# EAGLE design Feedback-Circuit (EAGLE 9.6.2)
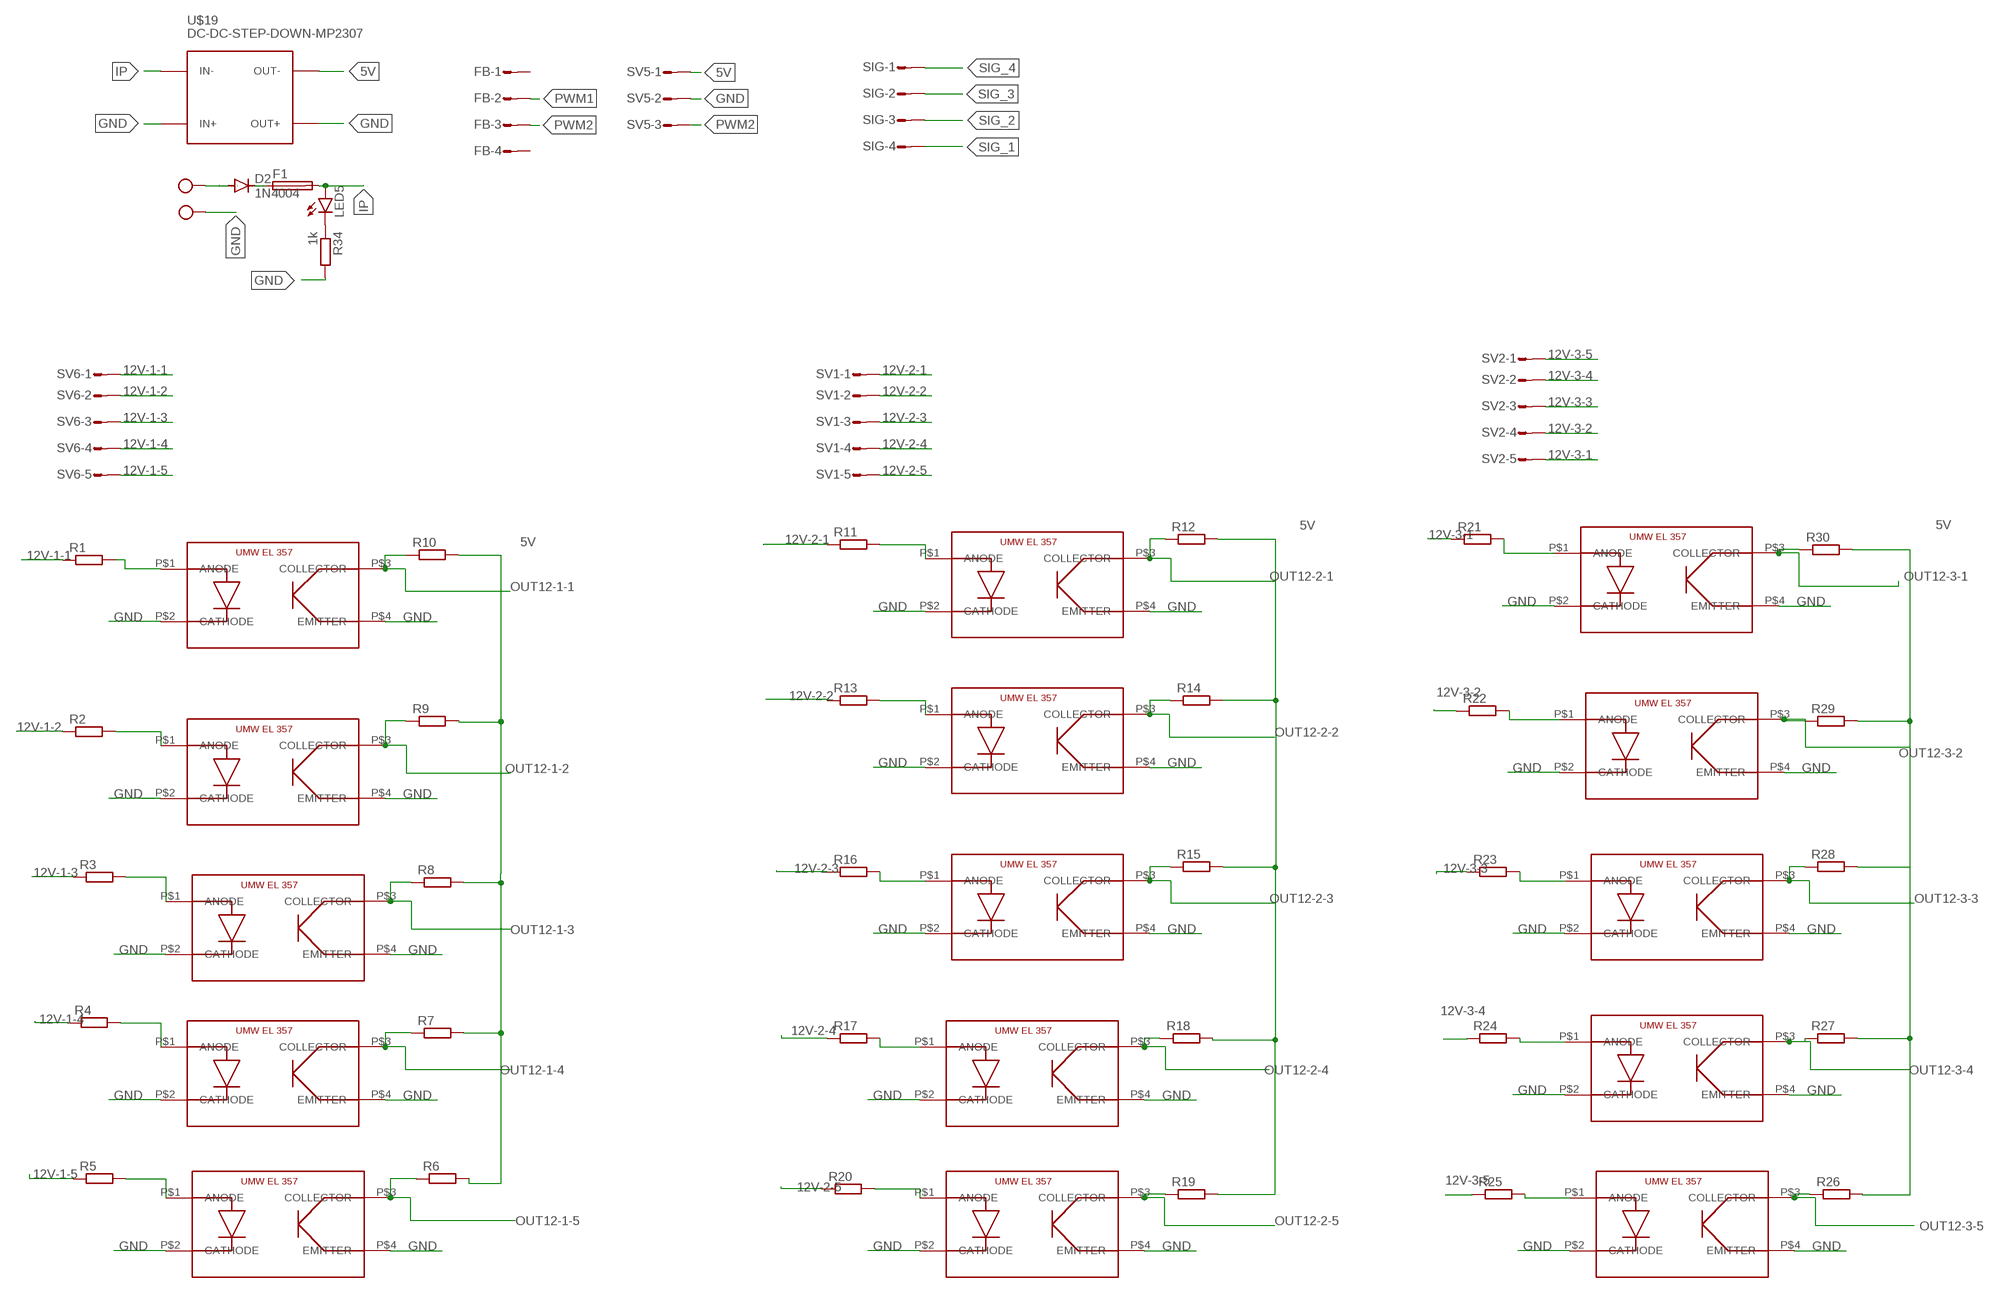
[diagram p0: schematic, sheet 1, part 1 of 2]
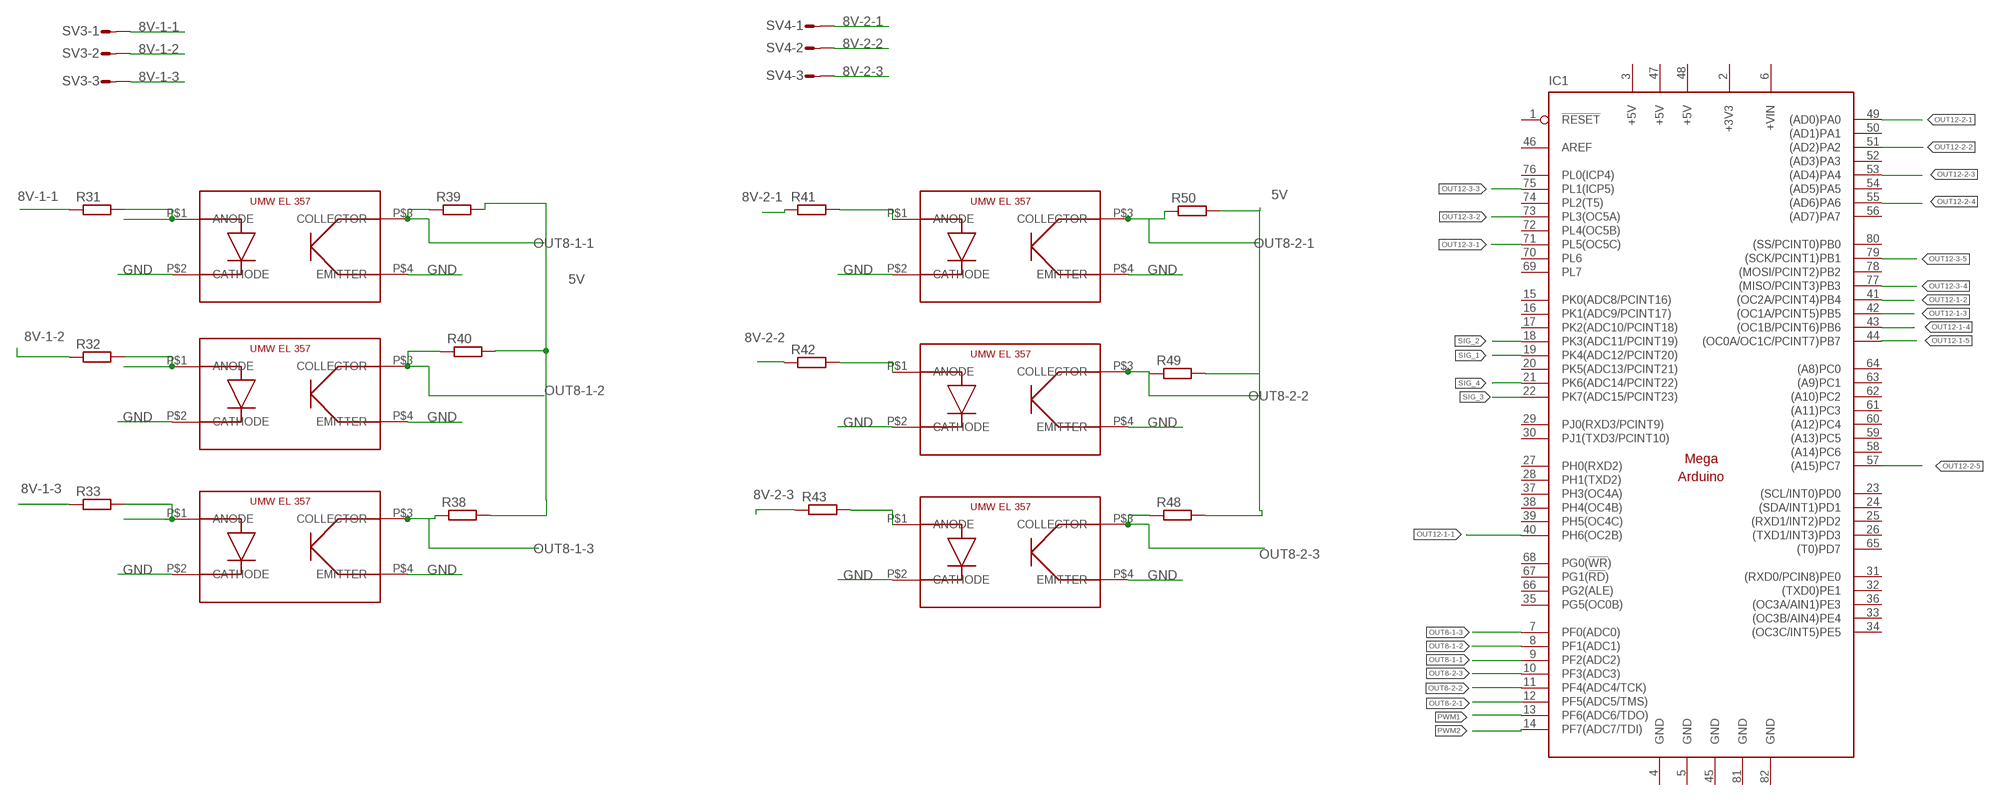
[diagram p1: schematic, sheet 1, part 2 of 2]

## Parts
D2  1N4004  [DO41-10]
F1  FUSE_SH22  [FUSE_SH22]
FB  CON-AMP-MT_S04P  [CON-AMP-MT_S04P]
IC1  MEGAARDUINO_1  [MEGA_ARDUINO]
LED5  LED3MM  [LED3MM]
MAIN-12V  AK300/2  [AK300/2]
R1  R-EU_R1206W  [R1206W]
R2  R-EU_R1206W  [R1206W]
R3  R-EU_R1206W  [R1206W]
R4  R-EU_R1206W  [R1206W]
R5  R-EU_R1206W  [R1206W]
R6  R-EU_R1206W  [R1206W]
R7  R-EU_R1206W  [R1206W]
R8  R-EU_R1206W  [R1206W]
R9  R-EU_R1206W  [R1206W]
R10  R-EU_R1206W  [R1206W]
R11  R-EU_R1206W  [R1206W]
R12  R-EU_R1206W  [R1206W]
R13  R-EU_R1206W  [R1206W]
R14  R-EU_R1206W  [R1206W]
R15  R-EU_R1206W  [R1206W]
R16  R-EU_R1206W  [R1206W]
R17  R-EU_R1206W  [R1206W]
R18  R-EU_R1206W  [R1206W]
R19  R-EU_R1206W  [R1206W]
R20  R-EU_R1206W  [R1206W]
R21  R-EU_R1206W  [R1206W]
R22  R-EU_R1206W  [R1206W]
R23  R-EU_R1206W  [R1206W]
R24  R-EU_R1206W  [R1206W]
R25  R-EU_R1206W  [R1206W]
R26  R-EU_R1206W  [R1206W]
R27  R-EU_R1206W  [R1206W]
R28  R-EU_R1206W  [R1206W]
R29  R-EU_R1206W  [R1206W]
R30  R-EU_R1206W  [R1206W]
R31  R-EU_R1206W  [R1206W]
R32  R-EU_R1206W  [R1206W]
R33  R-EU_R1206W  [R1206W]
R34  1k  R-EU_0207/10  [0207/10]
R38  R-EU_R1206W  [R1206W]
R39  R-EU_R1206W  [R1206W]
R40  R-EU_R1206W  [R1206W]
R41  R-EU_R1206W  [R1206W]
R42  R-EU_R1206W  [R1206W]
R43  R-EU_R1206W  [R1206W]
R48  R-EU_R1206W  [R1206W]
R49  R-EU_R1206W  [R1206W]
R50  R-EU_R1206W  [R1206W]
SIG  CON-AMP-MT_S04P  [CON-AMP-MT_S04P]
SV1  CON-AMP-MT_S05P  [CON-AMP-MT_S05P]
SV2  CON-AMP-MT_S05P  [CON-AMP-MT_S05P]
SV3  CON-AMP-MT_S05P  [CON-AMP-MT_S05P]
SV4  CON-AMP-MT_S05P  [CON-AMP-MT_S05P]
SV5  CON-AMP-MT_S03P  [CON-AMP-MT_S03P]
SV6  CON-AMP-MT_S05P  [CON-AMP-MT_S05P]
U$1  UMWEL357EL357  [OPTOCOUPLER]
U$2  UMWEL357EL357  [OPTOCOUPLER]
U$3  UMWEL357EL357  [OPTOCOUPLER]
U$4  UMWEL357EL357  [OPTOCOUPLER]
U$5  UMWEL357EL357  [OPTOCOUPLER]
U$6  UMWEL357EL357  [OPTOCOUPLER]
U$7  UMWEL357EL357  [OPTOCOUPLER]
U$8  UMWEL357EL357  [OPTOCOUPLER]
U$9  UMWEL357EL357  [OPTOCOUPLER]
U$10  UMWEL357EL357  [OPTOCOUPLER]
U$11  UMWEL357EL357  [OPTOCOUPLER]
U$12  UMWEL357EL357  [OPTOCOUPLER]
U$13  UMWEL357EL357  [OPTOCOUPLER]
U$14  UMWEL357EL357  [OPTOCOUPLER]
U$15  UMWEL357EL357  [OPTOCOUPLER]
U$16  UMWEL357EL357  [OPTOCOUPLER]
U$17  UMWEL357EL357  [OPTOCOUPLER]
U$18  UMWEL357EL357  [OPTOCOUPLER]
U$19  DC-DC-STEP-DOWN-MP2307  [DC-DC-STEP-DOWN-MP2307]
U$21  UMWEL357EL357  [OPTOCOUPLER]
U$22  UMWEL357EL357  [OPTOCOUPLER]
U$23  UMWEL357EL357  [OPTOCOUPLER]

## Nets
5V: R6.2 R7.2 R8.2 R9.2 R10.2 R12.2 R14.2 R15.2 R18.2 R19.2 R26.2 R27.2 R28.2 R29.2 R30.2 R38.2 R39.2 R40.2 R48.2 R49.2 R50.2 SV5.1 U$19.OUT-
8V-1-1: R31.1 SV3.1
8V-1-2: R32.1 SV3.2
8V-1-3: R33.1 SV3.3
8V-2-1: R41.1 SV4.1
8V-2-2: R42.1 SV4.2
8V-2-3: R43.1 SV4.3
12V: D2.A MAIN-12V.1
12V-1-1: R1.1 SV6.1
12V-1-2: R2.1 SV6.2
12V-1-3: R3.1 SV6.3
12V-1-4: R4.1 SV6.4
12V-1-5: R5.1 SV6.5
12V-2-1: R11.1 SV1.1
12V-2-2: R13.1 SV1.2
12V-2-3: R16.1 SV1.3
12V-2-4: R17.1 SV1.4
12V-2-5: R20.1 SV1.5
12V-3-1: R21.1 SV2.5
12V-3-2: R22.1 SV2.4
12V-3-3: R23.1 SV2.3
12V-3-4: R24.1 SV2.2
12V-3-5: R25.1 SV2.1
GND: MAIN-12V.2 R34.2 SV5.2 U$1.P$2(CATHODE) U$1.P$4(EMITTER) U$2.P$2(CATHODE) U$2.P$4(EMITTER) U$3.P$2(CATHODE) U$3.P$4(EMITTER) U$4.P$2(CATHODE) U$4.P$4(EMITTER) U$5.P$2(CATHODE) U$5.P$4(EMITTER) U$6.P$2(CATHODE) U$6.P$4(EMITTER) U$7.P$2(CATHODE) U$7.P$4(EMITTER) U$8.P$2(CATHODE) U$8.P$4(EMITTER) U$9.P$2(CATHODE) U$9.P$4(EMITTER) U$10.P$2(CATHODE) U$10.P$4(EMITTER) U$11.P$2(CATHODE) U$11.P$4(EMITTER) U$12.P$2(CATHODE) U$12.P$4(EMITTER) U$13.P$2(CATHODE) U$13.P$4(EMITTER) U$14.P$2(CATHODE) U$14.P$4(EMITTER) U$15.P$2(CATHODE) U$15.P$4(EMITTER) U$16.P$2(CATHODE) U$16.P$4(EMITTER) U$17.P$2(CATHODE) U$17.P$4(EMITTER) U$18.P$2(CATHODE) U$18.P$4(EMITTER) U$19.IN+ U$19.OUT+ U$21.P$2(CATHODE) U$21.P$4(EMITTER) U$22.P$2(CATHODE) U$22.P$4(EMITTER) U$23.P$2(CATHODE) U$23.P$4(EMITTER)
IP: F1.2 LED5.A U$19.IN-
N$1: R11.2 U$6.P$1(ANODE)
N$3: R2.2 U$2.P$1(ANODE)
N$5: R3.2 U$3.P$1(ANODE)
N$6: R1.2 U$1.P$1(ANODE)
N$7: R4.2 U$4.P$1(ANODE)
N$9: R5.2 U$5.P$1(ANODE)
N$10: R13.2 U$7.P$1(ANODE)
N$11: R16.2 U$8.P$1(ANODE)
N$13: R17.2 U$9.P$1(ANODE)
N$14: R20.2 U$10.P$1(ANODE)
N$15: R21.2 U$11.P$1(ANODE)
N$16: R22.2 U$12.P$1(ANODE)
N$17: R23.2 U$13.P$1(ANODE)
N$18: R24.2 U$14.P$1(ANODE)
N$19: R25.2 U$15.P$1(ANODE)
N$20: R41.2 U$21.P$1(ANODE)
N$21: R42.2 U$22.P$1(ANODE)
N$22: R43.2 U$23.P$1(ANODE)
N$31: R31.2 U$16.P$1(ANODE)
N$33: R32.2 U$17.P$1(ANODE)
N$35: R33.2 U$18.P$1(ANODE)
N$42: LED5.K(C) R34.1
N$46: D2.C F1.1
OUT8-1-1: IC1.9(PF2(ADC2)) R39.1 U$16.P$3(COLLECTOR)
OUT8-1-2: IC1.8(PF1(ADC1)) R40.1 U$17.P$3(COLLECTOR)
OUT8-1-3: IC1.7(PF0(ADC0)) R38.1 U$18.P$3(COLLECTOR)
OUT8-2-1: IC1.12(PF5(ADC5/TMS)) R50.1 U$21.P$3(COLLECTOR)
OUT8-2-2: IC1.11(PF4(ADC4/TCK)) R49.1 U$22.P$3(COLLECTOR)
OUT8-2-3: IC1.10(PF3(ADC3)) R48.1 U$23.P$3(COLLECTOR)
OUT12-1-1: IC1.40(PH6(OC2B)) R10.1 U$1.P$3(COLLECTOR)
OUT12-1-2: IC1.41((OC2A/PCINT4)PB4) R9.1 U$2.P$3(COLLECTOR)
OUT12-1-3: IC1.42((OC1A/PCINT5)PB5) R8.1 U$3.P$3(COLLECTOR)
OUT12-1-4: IC1.43((OC1B/PCINT6)PB6) R7.1 U$4.P$3(COLLECTOR)
OUT12-1-5: IC1.44((OC0A/OC1C/PCINT7)PB7) R6.1 U$5.P$3(COLLECTOR)
OUT12-2-1: IC1.49((AD0)PA0) R12.1 U$6.P$3(COLLECTOR)
OUT12-2-2: IC1.51((AD2)PA2) R14.1 U$7.P$3(COLLECTOR)
OUT12-2-3: IC1.53((AD4)PA4) R15.1 U$8.P$3(COLLECTOR)
OUT12-2-4: IC1.55((AD6)PA6) R18.1 U$9.P$3(COLLECTOR)
OUT12-2-5: IC1.57((A15)PC7) R19.1 U$10.P$3(COLLECTOR)
OUT12-3-1: IC1.71(PL5(OC5C)) R30.1 U$11.P$3(COLLECTOR)
OUT12-3-2: IC1.73(PL3(OC5A)) R29.1 U$12.P$3(COLLECTOR)
OUT12-3-3: IC1.75(PL1(ICP5)) R28.1 U$13.P$3(COLLECTOR)
OUT12-3-4: IC1.77((MISO/PCINT3)PB3) R27.1 U$14.P$3(COLLECTOR)
OUT12-3-5: IC1.79((SCK/PCINT1)PB1) R26.1 U$15.P$3(COLLECTOR)
PWM1: FB.2 IC1.13(PF6(ADC6/TDO))
PWM2: FB.3 IC1.14(PF7(ADC7/TDI)) SV5.3
SIG_1: IC1.19(PK4(ADC12/PCINT20)) SIG.4
SIG_2: IC1.18(PK3(ADC11/PCINT19)) SIG.3
SIG_3: IC1.22(PK7(ADC15/PCINT23)) SIG.2
SIG_4: IC1.21(PK6(ADC14/PCINT22)) SIG.1
Unconnected: FB.1 FB.4 IC1.1(!RESET) IC1.15(PK0(ADC8/PCINT16)) IC1.16(PK1(ADC9/PCINT17)) IC1.17(PK2(ADC10/PCINT18)) IC1.20(PK5(ADC13/PCINT21)) IC1.23((SCL/INT0)PD0) IC1.24((SDA/INT1)PD1) IC1.25((RXD1/INT2)PD2) IC1.26((TXD1/INT3)PD3) IC1.27(PH0(RXD2)) IC1.28(PH1(TXD2)) IC1.29(PJ0(RXD3/PCINT9)) IC1.30(PJ1(TXD3/PCINT10)) IC1.31((RXD0/PCIN8)PE0) IC1.32((TXD0)PE1) IC1.33((OC3B/AIN4)PE4) IC1.34((OC3C/INT5)PE5) IC1.35(PG5(OC0B)) IC1.36((OC3A/AIN1)PE3) IC1.37(PH3(OC4A)) IC1.38(PH4(OC4B)) IC1.39(PH5(OC4C)) IC1.46(AREF) IC1.50((AD1)PA1) IC1.52((AD3)PA3) IC1.54((AD5)PA5) IC1.56((AD7)PA7) IC1.58((A14)PC6) IC1.59((A13)PC5) IC1.60((A12)PC4) IC1.61((A11)PC3) IC1.62((A10)PC2) IC1.63((A9)PC1) IC1.64((A8)PC0) IC1.65((T0)PD7) IC1.66(PG2(ALE)) IC1.67(PG1(!RD!)) IC1.68(PG0(!WR!)) IC1.69(PL7) IC1.70(PL6) IC1.72(PL4(OC5B)) IC1.74(PL2(T5)) IC1.76(PL0(ICP4)) IC1.78((MOSI/PCINT2)PB2) IC1.80((SS/PCINT0)PB0) SV3.4 SV3.5 SV4.4 SV4.5

## Power pins joined to a net without a drawn wire
+3V3: IC1.2(+3V3)
+5V: IC1.3(+5V) IC1.47(+5V) IC1.48(+5V)
+VIN: IC1.6(+VIN)
GND: IC1.4(GND) IC1.5(GND) IC1.45(GND) IC1.81(GND) IC1.82(GND)

## Library data of the parts
D2 = diode:1N4004: DIODE general purpose rectifier, 1 A
F1 = MindCloud:FUSE_SH22: FUSE HOLDER CS PFP30, Schukat; OC_FARNELL: unknown; OC_NEWARK: unknown
FB SIG = MindCloud:CON-AMP-MT_S04P: AMP MT CONNECTOR; OC_FARNELL: unknown; OC_NEWARK: unknown
IC1 = MindCloud:MEGAARDUINO_1: The Arduino Mega is a microcontroller board based on the ATmega1280. - 54 digital input/output pins (of which 14 can be used as PWM outputs) - 16 analog inputs - 4 UARTs (hardware serial ports) - 16 MHz crystal oscillator - USB connection - power jack - ICSP header - reset button It contains everything needed to support the microcontroller; simply connect it to a computer with a USB cable or power it with a AC-to-DC adapter or battery to get started. The Mega is compatible with most shields designed for the Arduino Duemilanove or Diecimila. http://arduino.cc/en/Main/ArduinoBoardMega
LED5 = led:LED: LED OSRAM: - CHIPLED LG R971, LG N971, LY N971, LG Q971, LY Q971, LO R971, LY R971 LH N974, LH R974 LS Q976, LO Q976, LY Q976 LO Q996 - Hyper CHIPLED LW Q18S LB Q993, LB Q99A, LB R99A - SideLED LS A670, LO A670, LY A670, LG A670, LP A670 LB A673, LV A673, LT A673, LW A673 LH A674 LY A675 LS A676, LA A676, LO A676, LY A676, LW A676 LS A679, LY A679, LG A679 - Hyper Micro SIDELED® LS Y876, LA Y876, LO Y876, LY Y876 LT Y87S - SmartLED LW L88C, LW L88S LB L89C, LB L89S, LG L890 LS L89K, LO L89K, LY L89K LS L896, LA L896, LO L896, LY L896 - TOPLED LS T670, LO T670, LY T670, LG T670, LP T670 LSG T670, LSP T670, LSY T670, LOP T670, LYG T670 LG T671, LOG T671, LSG T671 LB T673, LV T673, LT T673, LW T673 LH T674 LS T676, LA T676, LO T676, LY T676, LB T676, LH T676, LSB T676, LW T676 LB T67C, LV T67C, LT T67C, LS T67K, LO T67K, LY T67K, LW E67C LS E67B, LA E67B, LO E67B, LY E67B, LB E67C, LV E67C, LT E67C LW T67C LS T679, LY T679, LG T679 LS T770, LO T770, LY T770, LG T770, LP T770 LB T773, LV T773, LT T773, LW T773 LH T774 LS E675, LA E675, LY E675, LS T675 LS T776, LA T776, LO T776, LY T776, LB T776 LHGB T686 LT T68C, LB T68C - Hyper Mini TOPLED® LB M676 - Mini TOPLED Santana® LG M470 LS M47K, LO M47K, LY M47K Source: http://www.osram.convergy.de LUXEON: - LUMILED® LXK2-PW12-R00, LXK2-PW12-S00, LXK2-PW14-U00, LXK2-PW14-V00 LXK2-PM12-R00, LXK2-PM12-S00, LXK2-PM14-U00 LXK2-PE12-Q00, LXK2-PE12-R00, LXK2-PE12-S00, LXK2-PE14-T00, LXK2-PE14-U00 LXK2-PB12-K00, LXK2-PB12-L00, LXK2-PB12-M00, LXK2-PB14-N00, LXK2-PB14-P00, LXK2-PB14-Q00 LXK2-PR12-L00, LXK2-PR12-M00, LXK2-PR14-Q00, LXK2-PR14-R00 LXK2-PD12-Q00, LXK2-PD12-R00, LXK2-PD12-S00 LXK2-PH12-R00, LXK2-PH12-S00 LXK2-PL12-P00, LXK2-PL12-Q00, LXK2-PL12-R00 Source: www.luxeon.com KINGBRIGHT: KA-3528ASYC Source: www.kingbright.com
MAIN-12V = con-ptr500:AK300/2: CONNECTOR; OC_FARNELL: unknown; OC_NEWARK: unknown
R1-R34 R38-R43 R48-R50 = rcl:R-EU_: RESISTOR, European symbol; SPICEPREFIX: R
SV1-SV4 SV6 = MindCloud:CON-AMP-MT_S05P: AMP MT CONNECTOR; OC_FARNELL: unknown; OC_NEWARK: unknown
SV5 = MindCloud:CON-AMP-MT_S03P: AMP MT CONNECTOR; OC_FARNELL: unknown; OC_NEWARK: unknown
U$1-U$18 U$21-U$23 = EL357 optocoupler:UMWEL357
U$19 = buck 3A:DC-DC-STEP-DOWN-MP2307: DC/DC Step-Down Regulator based on MP2307DN chip MP2307 datasheet available here: https://cdn-shop.adafruit.com/datasheets/MP2307_r1.9.pdf Click here to find device on ebay.com <http://www.ebay.com/sch/dc+dc+3a+mini+converter>

## Board
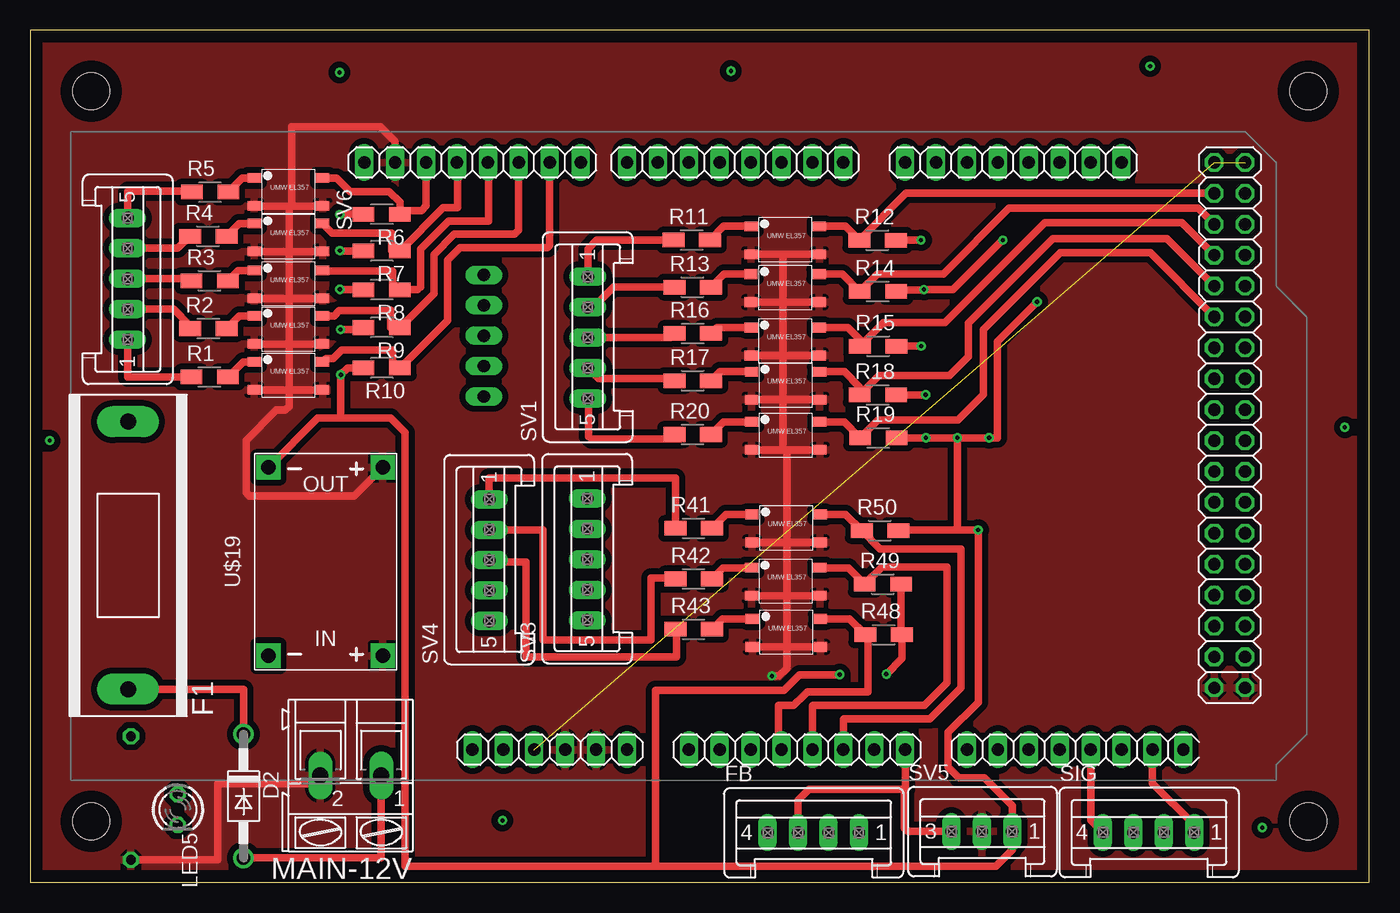
[diagram p2: board, top side]
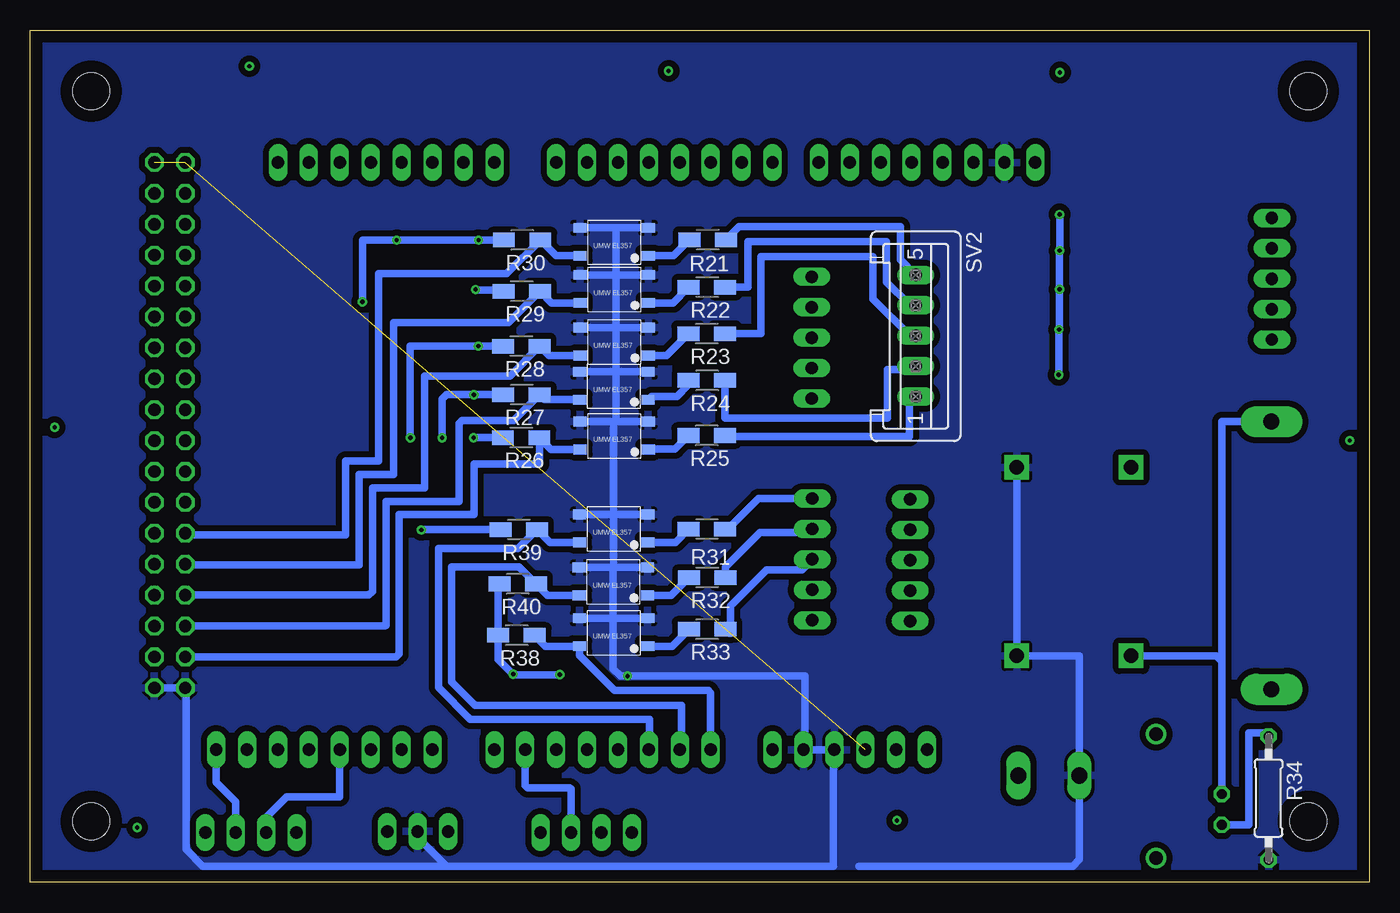
[diagram p3: board, bottom side, seen from below]

Size 110 x 70 mm. Coordinates in mm from the lower left corner, seen from the top.
Outline: 0,0 110,0 110,70 0,70 0,0
Copper layers (1*16): Top 0.035mm / dielectric 1.5mm / Bottom 0.035mm
Design rules "default *": minimum track width 0.6mm, minimum drill 0.35mm, track to track 0.5mm, track to pad 0.5mm, pad to pad 0.5mm, via to via 0.5mm, smd to smd 6mil, copper to edge 40mil, drill to drill 6mil, minimum pad ring 10mil, minimum via ring 8mil, stop-mask expansion 4mil, vias tented up to drill 0mil, thermal gap 10mil
Holes 3 mm at 105,65 105,5 5,5 5,65

### Footprints (pad centres in the part's own frame; a part is rotated, then mirrored left to right if it is on the bottom)
DO41-10 = drill 1.118: A 5.08,0; C -5.08,0
FUSE_SH22 = drill 1.321 pad 2.54 long: 1 -10.998,0; 2 10.998,0
CON-AMP-MT_S04P = drill 1.016 long: 1 3.75,0; 2 1.25,0; 3 -1.25,0; 4 -3.75,0
MEGA_ARDUINO = drill 1.016 long: 1 33.02,2.54; 2 35.56,2.54; 3 38.1,2.54; 4 40.64,2.54; 5 43.18,2.54; 6 45.72,2.54; 7 50.8,2.54; 8 53.34,2.54; 9 55.88,2.54; 10 58.42,2.54; 11 60.96,2.54; 12 63.5,2.54; 13 66.04,2.54; 14 68.58,2.54; 15 73.66,2.54; 16 76.2,2.54; 17 78.74,2.54; 18 81.28,2.54; 19 83.82,2.54; 20 86.36,2.54; 21 88.9,2.54; 22 91.44,2.54; 23 86.36,50.8; 24 83.82,50.8; 25 81.28,50.8; 26 78.74,50.8; 27 76.2,50.8; 28 73.66,50.8; 29 71.12,50.8; 30 68.58,50.8; 31 63.5,50.8; 32 60.96,50.8; 33 58.42,50.8; 34 55.88,50.8; 35 53.34,50.8; 36 50.8,50.8; 37 48.26,50.8; 38 45.72,50.8; 39 41.91,50.8; 40 39.37,50.8; 41 36.83,50.8; 42 34.29,50.8; 43 31.75,50.8; 44 29.21,50.8; 45 26.67,50.8; 46 24.13,50.8 | drill 1.016 octagon: 47 93.98,50.8; 48 96.52,50.8; 49 93.98,48.26; 50 96.52,48.26; 51 93.98,45.72; 52 96.52,45.72; 53 93.98,43.18; 54 96.52,43.18; 55 93.98,40.64; 56 96.52,40.64; 57 93.98,38.1; 58 96.52,38.1; 59 93.98,35.56; 60 96.52,35.56; 61 93.98,33.02; 62 96.52,33.02; 63 93.98,30.48; 64 96.52,30.48; 65 93.98,27.94; 66 96.52,27.94; 67 93.98,25.4; 68 96.52,25.4; 69 93.98,22.86; 70 96.52,22.86; 71 93.98,20.32; 72 96.52,20.32; 73 93.98,17.78; 74 96.52,17.78; 75 93.98,15.24; 76 96.52,15.24; 77 93.98,12.7; 78 96.52,12.7; 79 93.98,10.16; 80 96.52,10.16; 81 93.98,7.62; 82 96.52,7.62
LED3MM = drill 0.813 octagon: A -1.27,0; K 1.27,0
AK300/2 = drill 1.321 long: 1 -2.515,0; 2 2.489,0
R1206W = smd 1.8 x 1.2: 1 -1.499,0; 2 1.499,0
0207/10 = drill 0.813 octagon: 1 -5.08,0; 2 5.08,0
CON-AMP-MT_S05P = drill 1.016 long: 1 5,0; 2 2.5,0; 3 0,0; 4 -2.5,0; 5 -5,0
CON-AMP-MT_S03P = drill 1.016 long: 1 2.5,0; 2 0,0; 3 -2.5,0
OPTOCOUPLER = smd 1.1 x 0.8: P$1 -0.6,2.9; P$2 -0.6,0.6; P$3 5,2.9; P$4 5,0.6
DC-DC-STEP-DOWN-MP2307 = drill 1.2 pad 2 square: IN+ -7.747,-4.699; IN- -7.747,4.699; OUT+ 7.747,-4.699; OUT- 7.747,4.699

### Placement (x,y rotation side)
D2  17.51,7.07 270 top
F1  8.03,26.85 90 top
FB  64.33,4.06 0 top
IC1  3.3,8.35 0 top
LED5  12.11,5.97 270 top
MAIN-12V  26.31,8.76 180 top
R1  14.73,41.52 0 top
R2  14.63,45.5 0 top
R3  14.73,49.43 0 top
R4  14.61,53.08 0 top
R5  14.77,56.72 0 top
R6  28.86,54.89 180 top
R7  28.86,51.88 180 top
R8  28.86,48.68 180 top
R9  28.86,45.58 180 top
R10  28.86,42.26 180 top
R11  54.34,52.77 0 top
R12  69.61,52.76 0 top
R13  54.41,48.89 0 top
R14  69.64,48.55 0 top
R15  69.67,44.04 0 top
R16  54.43,45.09 0 top
R17  54.43,41.21 0 top
R18  69.64,40.05 0 top
R19  69.68,36.52 0 top
R20  54.42,36.79 0 top
R21  54.34,52.8 180 bottom
R22  54.41,48.89 180 bottom
R23  54.43,45.08 180 bottom
R24  54.41,41.23 180 bottom
R25  54.44,36.71 180 bottom
R26  69.68,36.53 180 bottom
R27  69.65,40.06 180 bottom
R28  69.66,44.05 180 bottom
R29  69.62,48.57 180 bottom
R30  69.6,52.77 180 bottom
R31  54.42,29.01 180 bottom
R32  54.38,25.03 180 bottom
R33  54.4,20.78 180 bottom
R34  8.26,6.91 270 bottom
R38  70.06,20.29 180 bottom
R39  69.87,28.97 180 bottom
R40  69.95,24.51 180 bottom
R41  54.5,29.08 0 top
R42  54.5,24.92 0 top
R43  54.5,20.79 0 top
R48  70.11,20.34 0 top
R49  70.05,24.49 0 top
R50  69.81,28.89 0 top
SIG  91.88,4.09 0 top
SV1  45.8,44.75 90 top
SV2  37.26,44.91 270 bottom
SV3  45.75,26.53 90 top
SV4  37.7,26.46 90 top
SV5  78.18,4.16 0 top
SV6  7.99,49.59 270 top
U$1  19,39.86 0 top
U$2  19,43.64 0 top
U$3  19,47.37 0 top
U$4  19,51.24 0 top
U$5  19,54.97 0 top
U$6  59.82,51 0 top
U$7  59.81,47.07 0 top
U$8  59.82,42.68 0 top
U$9  59.85,39.05 0 top
U$10  59.87,34.93 0 top
U$11  59.84,54.38 180 bottom
U$12  59.82,50.51 180 bottom
U$13  59.82,46.18 180 bottom
U$14  59.85,42.55 180 bottom
U$15  59.84,38.46 180 bottom
U$16  59.88,30.82 180 bottom
U$17  59.89,26.46 180 bottom
U$18  59.88,22.29 180 bottom
U$19  24.26,26.35 90 top
U$21  59.89,27.32 0 top
U$22  59.86,22.94 0 top
U$23  59.92,18.74 0 top

### Tracks (layer width: path | path; a pad name or v marks a point on that pad's centre or on a via)
5V  (via drill 0.35)
  Top 0.6: U$19.OUT- 23.6,38.14 25.57,38.14 25.56,38.15 | R9.2 26.61,45.41 v25.48,45.41 | v25.42,48.71 25.48,48.71 25.51,48.68 R8.2 | v25.43,51.9 25.45,51.88 R7.2 | v25.43,54.87 25.45,54.89 R6.2 | R10.2 26.06,42.26 v25.5,41.7 25.5,38.21 25.56,38.15 | 51.37,1.32 79.32,1.32 80.68,2.68 SV5.1 80.68,6.26 78.37,8.57 76.31,8.57 75.4,9.48 75.4,12.3 77.88,14.78 v77.88,28.94 | 51.37,1.32 30.77,1.32 30.77,36.96 29.58,38.15 25.56,38.15 | 71.3,36.64 R19.2 v73.58,36.52 v76.18,36.52 | 71.61,24.43 R49.2 71.55,20.4 R48.2 71.61,18.37 v70.33,17.09 | R50.2 71.36,28.94 76.18,28.94 | v77.88,28.94 76.25,28.94 76.18,28.94 | v66.5,17.05 63.2,17.05 61.91,15.76 51.37,15.76 51.37,1.32 | v77.88,28.94 77.88,15.7 | v76.18,36.52 v78.78,36.52 79.44,36.52 79.44,44.41 v82.72,47.69 | R14.2 71.24,48.65 73.37,48.65 v73.43,48.71 75.79,48.71 79.85,52.77 v79.9,52.77 | R18.2 v73.55,40.05 v73.56,40.06 | R12.2 v73.17,52.76 v73.18,52.77 | R15.2 v73.19,44.04 v73.2,44.05 | v77.88,28.94 77.88,28.97 | v76.18,36.52 76.18,28.94
  Bottom 0.6: 25.43,48.72 25.43,45.46 v25.48,45.41 25.48,41.72 v25.5,41.7 | 25.43,48.72 v25.43,51.9 v25.43,54.87 | 25.43,48.72 v25.42,48.71 | 71.45,28.89 R39.2 77.85,28.97 v77.88,28.94 | R40.2 71.56,24.4 R38.2 71.56,18.32 v70.33,17.09 70.29,17.05 v66.5,17.05 | R30.2 v73.18,52.77 v79.9,52.77 82.72,52.77 v82.72,47.69 | R29.2 71.19,48.64 73.36,48.64 v73.43,48.71 | R26.2 v73.57,36.53 v73.58,36.52 | R27.2 v73.56,40.06 75.81,40.06 76.18,39.69 v76.18,36.52 | v78.78,36.52 78.81,36.55 78.81,44.05 v73.2,44.05 R28.2
8V-1-1
  Bottom 0.6: SV3.1 50.16,31.53 52.79,28.9 52.81,28.9 R31.1
8V-1-2
  Bottom 0.6: SV3.2 46.05,28.73 50.05,28.73 52.88,25.9 R32.1
8V-1-3
  Bottom 0.6: SV3.3 46.62,25.66 49.53,25.66 52.47,22.72 52.47,20.44 52.56,20.44 R33.1
8V-2-1
  Top 0.6: SV4.1 37.7,33.22 53,33.22 R41.1
8V-2-2
  Top 0.6: SV4.2 42.13,28.96 42.13,19.92 51,19.92 51,24.99 52.93,24.99 R42.1
8V-2-3
  Top 0.6: SV4.3 37.86,26.3 40.71,26.3 40.71,18.52 53.11,18.52 53.11,20.68 R43.1
12V
  Top 0.6: MAIN-12V.1 28.82,1.99 D2.A
12V-1-1
  Top 0.6: R1.1 7.99,41.51 SV6.1
12V-1-2
  Top 0.6: SV6.2 11.76,47.09 13.13,45.72 R2.1
12V-1-3
  Top 0.6: SV6.3 13.07,49.59 R3.1
12V-1-4
  Top 0.6: SV6.4 12.12,52.09 R4.1
12V-1-5
  Top 0.6: SV6.5 7.99,56.75 8.04,56.8 13.19,56.8 R5.1
12V-2-1
  Top 0.6: SV1.1 45.8,52.04 46.53,52.77 R11.1
12V-2-2
  Top 0.6: SV1.2 46.27,47.25 46.97,47.95 47.91,48.89 R13.1
12V-2-3
  Top 0.6: SV1.3 52.59,44.75 R16.1
12V-2-4
  Top 0.6: R17.1 52.77,41.37 46.68,41.37 SV1.4
12V-2-5
  Top 0.6: 45.8,39.71 SV1.5 45.88,39.67 45.88,36.64 46.09,36.43 53.42,36.43 53.06,36.79 R20.1
12V-3-1
  Bottom 0.6: SV2.5 38.5,51.15 38.5,53.87 51.77,53.87 R21.1
12V-3-2
  Bottom 0.6: SV2.4 37.73,47.41 39.65,49.33 39.65,52.66 51.05,52.66 51.05,48.89 R22.1
12V-3-3
  Bottom 0.6: SV2.3 37.73,44.91 40.75,47.93 40.75,51.41 49.94,51.41 49.95,51.4 49.95,45.08 R23.1
12V-3-4
  Bottom 0.6: SV2.2 37.56,42.11 39.58,42.11 39.58,38.99 39.58,38.16 52.91,38.16 R24.1
12V-3-5
  Bottom 0.6: R25.1 52.84,36.61 37.79,36.61 37.79,39.38 SV2.1
+5V  (2 unrouted)
GND  (via drill 0.35)
  Top 0.6: U$19.OUT+ 26.6,31.74 17.99,31.74 17.72,32.01 17.72,36.3 20.21,38.79 20.94,38.79 21.24,39.09 21.24,40.46 | U$5.P$2 21.35,55.57 | 21.35,55.57 U$5.P$4 | U$4.P$2 21.26,51.84 | 21.26,51.84 U$4.P$4 | U$3.P$2 21.35,47.97 | U$1.P$2 21.24,40.46 | 21.24,40.46 U$1.P$4 | 21.24,40.46 21.24,44.21 | 21.24,44.21 21.24,47.86 21.35,47.97 | 21.35,47.97 21.26,48.06 21.26,51.84 | 21.26,51.84 21.26,55.48 21.35,55.57 | 21.35,55.57 21.48,55.7 21.48,62.08 28.73,62.08 29.97,60.84 IC1.45 | U$21.P$4 62.17,27.92 | 62.17,27.92 U$21.P$2 | U$22.P$2 62.12,23.54 | 62.12,23.54 U$22.P$4 | U$23.P$4 62.13,19.34 | 62.13,19.34 U$23.P$2 | 62.17,27.92 62.17,23.59 | 62.17,23.59 62.17,19.38 | 62.17,19.38 62.13,19.34 | 62.17,23.59 62.12,23.54 | 62.17,19.38 62.17,17.58 61.53,16.94 v60.94,16.94 | U$6.P$2 61.72,51.6 | 61.72,51.6 U$6.P$4 | U$7.P$2 61.85,47.67 | U$7.P$4 61.85,47.67 | 61.99,43.28 U$8.P$4 | U$9.P$2 61.95,39.65 | 61.95,39.65 U$9.P$4 | U$10.P$4 61.98,35.53 | U$10.P$2 61.98,35.53 | 61.72,51.6 61.85,51.47 61.85,47.67 | 61.85,47.67 61.85,43.42 | 61.85,43.42 61.99,43.28 | 61.85,43.42 61.85,39.75 | 61.85,39.75 61.95,39.65 | 61.85,39.75 61.85,35.66 61.98,35.53 | 61.98,35.53 62.17,35.34 62.17,27.92 | U$3.P$4 21.35,47.97 | U$2.P$4 23.97,44.21 21.24,44.21 | U$2.P$2 21.21,44.24 21.24,44.21 | U$8.P$2 61.99,43.28 | R34.2 15.38,1.83 15.38,8.08 23.82,8.08 MAIN-12V.2
  Bottom 0.6: 41.91,1.32 24.34,1.32 23.8,1.86 23.8,8.74 MAIN-12V.2 23.82,18.6 U$19.IN+ U$19.OUT+ | U$16.P$4 62.1,30.22 | U$16.P$2 62.1,30.22 | U$17.P$4 62.14,25.86 | U$17.P$2 62.14,25.86 | U$18.P$4 62.04,21.68 | U$18.P$2 62.03,21.69 | 62.1,30.22 62.1,25.9 62.14,25.86 | 62.14,25.86 62.14,21.8 62.03,21.69 | 62.03,21.69 62.04,21.68 | 62.04,21.68 62.11,21.61 62.11,17.52 61.53,16.94 v60.94,16.94 46.37,16.94 46.37,11 IC1.5 IC1.4 44.01,10.82 44.01,1.32 75.81,1.32 | SV5.2 78.18,3.69 75.81,1.32 | 75.81,1.32 95.83,1.32 97.19,2.68 97.19,15.88 IC1.81 IC1.82 | U$11.P$2 61.67,53.78 | 61.67,53.78 U$11.P$4 | U$12.P$2 61.86,49.91 | 61.86,49.91 U$12.P$4 | U$13.P$2 61.86,45.58 | U$13.P$4 61.86,45.58 | U$15.P$2 62.04,37.86 | 62.04,37.86 U$15.P$4 | 61.67,53.78 61.86,53.59 61.86,49.91 | 61.86,49.91 61.86,45.58 | 61.86,45.58 61.86,42.03 | 61.86,42.03 61.86,38.04 62.04,37.86 | 61.78,41.95 61.86,42.03 | 61.78,41.95 61.94,41.95 | U$14.P$4 61.94,41.95 | 61.94,41.95 61.86,42.03 | U$14.P$2 61.78,41.95 | 62.04,37.86 62.1,37.8 62.1,30.22
  pour Top: 112.09,71.48 -0.16,71.48 -0.16,-1.77 112.04,-1.77
  pour Bottom: 112.17,71.67 112.17,-1.55 0,-1.55 0,71.66 112.12,71.66 112.12,71.56 112.16,71.56 112.16,71.66
IP
  Bottom 0.6: LED5.A 12.11,18.14 | U$19.IN- 12.57,18.6 12.11,18.14 | 12.11,18.14 12.11,37.85 F1.2
N$1
  Top 0.6: R11.2 56.97,53.9 U$6.P$1
N$2  (via drill 0.35)
  other vias: 25.4,66.54
N$3
  Top 0.6: R2.2 17.17,46.54 U$2.P$1
N$4  (via drill 0.35)
  other vias: 57.56,66.67
N$5
  Top 0.6: R3.2 17.07,50.27 U$3.P$1
N$6
  Top 0.6: R1.2 17.47,42.76 U$1.P$1
N$7
  Top 0.6: R4.2 17.17,54.14 U$4.P$1
N$8  (via drill 0.35)
  other vias: 92,67.06
N$9
  Top 0.6: R5.2 17.42,57.87 U$5.P$1
N$10
  Top 0.6: R13.2 56.99,49.97 U$7.P$1
N$11
  Top 0.6: R16.2 56.42,45.58 U$8.P$1
N$13
  Top 0.6: R17.2 56.67,41.95 U$9.P$1
N$14
  Top 0.6: R20.2 56.96,37.83 U$10.P$1
N$15
  Bottom 0.6: R21.2 57.16,51.48 U$11.P$1
N$16
  Bottom 0.6: R22.2 57.19,47.61 U$12.P$1
N$17
  Bottom 0.6: R23.2 57.73,43.28 U$13.P$1
N$18
  Bottom 0.6: R24.2 55.91,40.89 56.88,39.92 58.98,39.92 U$14.P$1
N$19
  Bottom 0.6: R25.2 57.04,35.6 59.2,35.6 U$15.P$1
N$20
  Top 0.6: U$21.P$1 57.14,30.22 R41.2
N$21
  Top 0.6: U$22.P$1 56.92,25.84 R42.2
N$22
  Top 0.6: U$23.P$1 56.85,21.64 R43.2
N$23  (via drill 0.35)
  other vias: 38.79,5.07
N$24  (via drill 0.35)
  other vias: 101.23,4.49
N$25  (via drill 0.35)
  other vias: 108.01,37.39
N$26  (via drill 0.35)
  other vias: 1.59,36.29
N$31
  Bottom 0.6: R31.2 57.01,27.92 U$16.P$1
N$33
  Bottom 0.6: R32.2 57.35,23.56 U$17.P$1
N$35
  Bottom 0.6: R33.2 57.29,19.39 U$18.P$1
N$42
  Bottom 0.6: LED5.K 9.89,4.7 9.89,12.25 8.52,12.25 R34.1
N$46
  Top 0.6: F1.1 17.51,15.85 D2.C
OUT8-1-1
  Bottom 0.6: U$16.P$3 67.32,27.92 R39.1 69.92,27.42 76.48,27.42 76.48,15.99 73.88,13.39 59.11,13.39 59.11,10.96 IC1.9
OUT8-1-2
  Bottom 0.6: U$17.P$3 67.5,23.56 R40.1 69.86,25.92 75.38,25.92 75.38,16.45 73.45,14.52 56.5,14.52 56.5,11.03 IC1.8
OUT8-1-3
  Bottom 0.6: 68.51,20.24 R38.1 67.66,19.39 U$18.P$3 64.88,18.62 62.02,15.76 54.29,15.76 54.1,15.57 IC1.7
OUT8-2-1
  Top 0.6: U$21.P$3 66.98,30.22 R50.1 69.81,27.39 76.46,27.39 76.46,15.95 73.93,13.42 66.84,13.42 66.8,13.38 IC1.12
OUT8-2-2
  Top 0.6: U$22.P$3 67.2,25.84 R49.1 69.95,25.89 75.31,25.89 75.31,16.37 73.46,14.52 64.29,14.52 64.26,14.49 IC1.11
OUT8-2-3
  Top 0.6: U$23.P$3 66.59,21.64 67.31,21.64 R48.1 68.8,20.15 68.8,15.62 63.83,15.62 63.57,15.36 62.72,14.51 61.48,14.51 61.48,11.13 IC1.10
OUT12-1-1
  Top 0.6: U$1.P$3 24.28,43.04 24.88,43.04 25.59,43.75 29.77,43.75 29.77,42.22 29.81,42.26 R10.1 34.26,46.16 34.26,51.11 35.29,52.14 42.51,52.14 42.67,52.3 IC1.40
OUT12-1-2
  Top 0.6: U$2.P$3 24.94,46.54 25.38,46.98 29.56,46.98 29.61,47.03 29.61,45.58 R9.1 33.16,48.38 33.16,51.57 34.83,53.24 39.78,53.24 40.13,53.59 IC1.41
OUT12-1-3
  Top 0.6: U$3.P$3 24.05,50.22 29.77,50.22 29.77,48.89 R8.1 31.83,48.68 32.06,48.91 32.06,52.02 34.38,54.34 37.65,54.34 37.65,59.09 IC1.42
OUT12-1-4
  Top 0.6: U$4.P$3 24.8,53.34 29.67,53.34 29.67,51.9 R7.1 33.92,55.44 35.11,55.44 35.11,59.09 IC1.43
OUT12-1-5
  Top 0.6: U$5.P$3 25.15,57.87 26.28,56.74 29.49,56.74 30.36,55.87 R6.1 30.67,55.2 32.12,55.2 32.51,55.59 IC1.44
OUT12-2-1
  Top 0.6: U$6.P$3 66.97,53.9 R12.1 71.96,56.61 IC1.49
OUT12-2-2
  Top 0.6: U$7.P$3 66.72,49.97 R14.1 69.58,49.99 75.02,49.99 80.41,55.38 95.97,55.38 IC1.51
OUT12-2-3
  Top 0.6: U$8.P$3 67.17,45.58 68.17,44.58 R15.1 70.11,45.98 75.16,45.98 83.37,54.19 94.62,54.19 IC1.53
OUT12-2-4
  Top 0.6: U$9.P$3 66.89,41.95 68.14,40.7 R18.1 69.71,41.62 75.5,41.62 77.08,43.2 77.08,45.96 84,52.88 93.39,52.88 IC1.55 97.01,49.26
OUT12-2-5
  Top 0.6: U$10.P$3 66.87,37.83 R19.1 69.65,37.99 76.23,37.99 78.32,40.08 78.32,45.42 84.62,51.72 92.01,51.72 IC1.57
OUT12-3-1
  Bottom 0.6: U$11.P$3 66.81,51.48 R30.1 70.86,50.01 81.38,50.01 81.38,34.6 84.09,34.6 84.09,28.53 97.14,28.53 IC1.71
OUT12-3-2
  Bottom 0.6: U$12.P$3 67.16,47.61 R29.1 70.71,45.98 80.16,45.98 80.16,33.5 82.99,33.5 82.99,26.08 97.23,26.08 IC1.73
OUT12-3-3
  Bottom 0.6: U$13.P$3 67.39,43.28 R28.1 70.6,41.61 77.6,41.61 77.6,32.4 81.89,32.4 81.89,23.91 82.21,23.59 IC1.75
OUT12-3-4
  Bottom 0.6: U$14.P$3 67.74,39.65 R27.1 70.28,37.93 74.54,37.93 74.78,37.69 74.78,31.3 80.79,31.3 80.79,21.11 80.85,21.05 IC1.77
OUT12-3-5
  Bottom 0.6: U$15.P$3 67.21,35.56 R26.1 | IC1.79 79.95,18.51 79.69,18.77 79.69,30.2 73.55,30.2 73.55,34.37 68.18,34.37 R26.1 | R26.1 68.31,36.53
PWM1
  Bottom 0.6: FB.2 65.58,7.65 65.61,7.68 65.69,7.76 69.14,7.76 69.34,7.96 IC1.13
PWM2
  Top 0.6: FB.3 63.08,6.71 63.98,7.61 71.89,7.61 | 71.89,7.61 IC1.14 | SV5.3 72.09,4.16 71.81,4.44 71.81,7.53 71.89,7.61
SIG_1
  Top 0.6: SIG.4 87.12,5.1 IC1.19
SIG_2
  Bottom 0.6: SIG.3 90.63,5.33 88.94,7.02 84.59,7.02 84.58,7.03 IC1.18
SIG_3
  Bottom 0.6: SIG.2 93.13,6.59 94.74,8.2 IC1.22
SIG_4
  Top 0.6: SIG.1 95.63,4.71 92.2,8.14 IC1.21